# Altium schematic sheet Sensors.A.Data.SchDoc
size A4; SheetNumber: 3; SheetTotal: 4
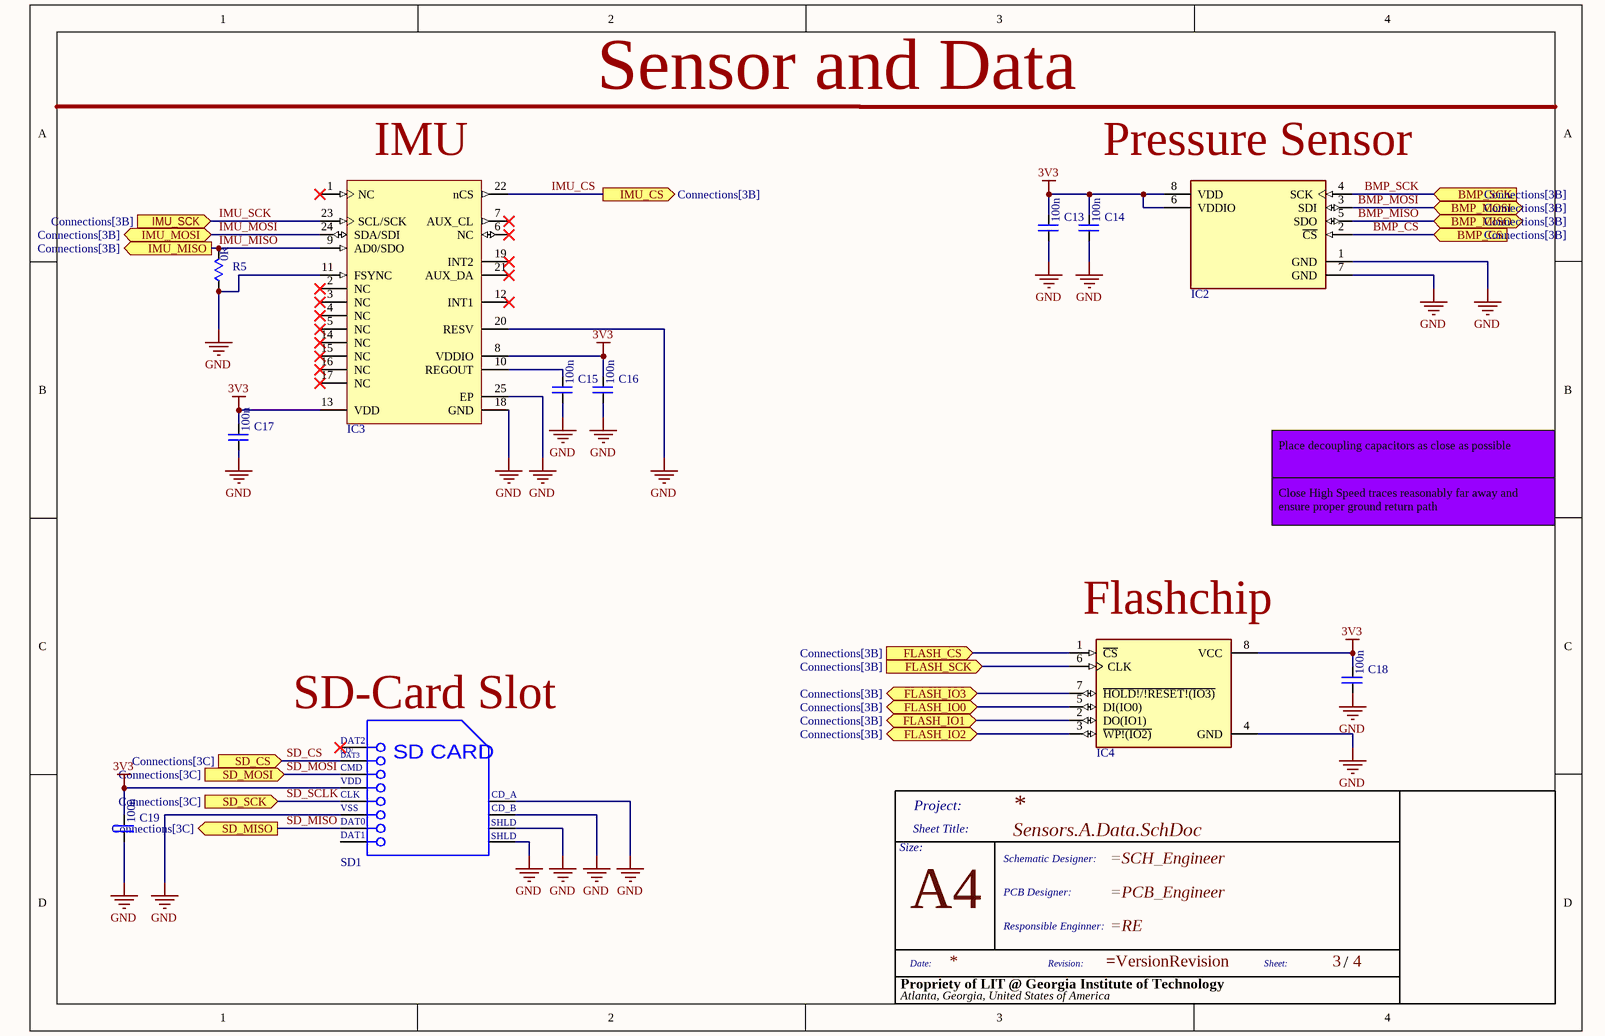
[diagram p0: Sensors.A.Data.SchDoc]

## Parts
*  Size: A4  (hidden comment: TitleBlock)  (graphical)
C13  KGM21NR71E104KT  [CAP-0805]  (value not drawn)
C14  KGM21NR71E104KT  [CAP-0805]  (value not drawn)
C15  KGM21NR71E104KT  [CAP-0805]  (value not drawn)
C16  KGM21NR71E104KT  [CAP-0805]  (value not drawn)
C17  KGM21NR71E104KT  [CAP-0805]  (value not drawn)
C18  KGM21NR71E104KT  [CAP-0805]  (value not drawn)
C19  KGM21NR71E104KT  [CAP-0805]  (value not drawn)
IC2  BME280  [BME280]  (value not drawn)
IC3  ICM-20649  [24-QFN]  (value not drawn)
IC4  W25Q32JVSSIQ  [F-SOIC127P790X216-8N]  (value not drawn)
R5  ERJ-6GEY0R00V  [0805-RES]  (value not drawn)
SD1  1040310811  [MOLX-104031-0811_V]  (value not drawn)

## Ports
BMP_CS (in, see Connections[3B]), BMP_MISO (bidir, see Connections[3B]), BMP_MOSI (bidir, see Connections[3B]), BMP_SCK (in, see Connections[3B]), FLASH_CS (in, see Connections[3B]), FLASH_IO0 (bidir, see Connections[3B]), FLASH_IO1 (bidir, see Connections[3B]), FLASH_IO2 (bidir, see Connections[3B]), FLASH_IO3 (bidir, see Connections[3B]), FLASH_SCK (in, see Connections[3B]), IMU_CS (out, see Connections[3B]), IMU_MISO (out, see Connections[3B]), IMU_MOSI (bidir, see Connections[3B]), IMU_SCK (in, see Connections[3B]), SD_CS (in, see Connections[3C]), SD_MISO (out, see Connections[3C]), SD_MOSI (in, see Connections[3C]), SD_SCK (in, see Connections[3C])

## Nets
3V3: C13.2 C14.2 C16.2 C17.2 C18.2 C19.2 IC2.6(VDDIO) IC2.8(VDD) IC3.8(VDDIO) IC3.13(VDD) IC4.8(VCC) SD1.4(VDD)
GND: C13.1 C14.1 C15.1 C16.1 C17.1 C18.1 C19.1 IC2.1(GND) IC2.7(GND) IC3.11(FSYNC) IC3.18(GND) IC3.20(RESV) IC3.25(EP) IC4.4(GND) R5.1 SD1.6(VSS2) SD1.9(CD_A) SD1.10(CD_B) SD1.11(SHLD1) SD1.12(SHLD2)
BMP_CS: IC2.2(~{CS}) ; port BMP_CS
BMP_MISO: IC2.5(SDO) ; port BMP_MISO
BMP_MOSI: IC2.3(SDI) ; port BMP_MOSI
BMP_SCK: IC2.4(SCK) ; port BMP_SCK
FLASH_CS: IC4.1(~{CS}) ; port FLASH_CS
FLASH_IO0: IC4.5(DI(IO0)) ; port FLASH_IO0
FLASH_IO1: IC4.2(DO(IO1)) ; port FLASH_IO1
FLASH_IO2: IC4.3(~{WP!(IO2)}) ; port FLASH_IO2
FLASH_IO3: IC4.7(~{HOLD!/!RESET!(IO3)}) ; port FLASH_IO3
FLASH_SCK: IC4.6(CLK) ; port FLASH_SCK
IMU_CS: IC3.22(nCS) ; port IMU_CS
IMU_MISO: IC3.9(AD0/SDO) R5.2 ; port IMU_MISO
IMU_MOSI: IC3.24(SDA/SDI) ; port IMU_MOSI
IMU_SCK: IC3.23(SCL/SCK) ; port IMU_SCK
SD_CS: SD1.2(CMD) ; port SD_CS
SD_MISO: SD1.7(DAT0) ; port SD_MISO
SD_MOSI: SD1.3(VSS1) ; port SD_MOSI
SD_SCLK: SD1.5(CLK) ; port SD_SCK
NetC15_2: C15.2 IC3.10(REGOUT)

Not connected (* = marked no-connect by the designer): IC3 1(NC)* 2(NC)* 3(NC)* 4(NC)* 5(NC)* 6(NC)* 7(AUX_CL)* 12(INT1)* 14(NC)* 15(NC)* 16(NC)* 17(NC)* 19(INT2)* 21(AUX_DA)*; SD1 1(CD/DAT3)* 8(DAT1)

## Notes on the sheet
- Sensor and Data
- (near IC3) IMU
- (near IC2) Pressure Sensor
- Close High Speed traces reasonably far away and ensure proper ground return path
- Place decoupling capacitors as close as possible
- (near IC4) Flashchip
- (near SD1) SD-Card Slot
- (in symbol CAP-0805-25V-100n) 100n
- (in symbol microSD-card-connector) DAT2; CD/; DAT3; SD CARD; VSS; SHLD
- (in symbol RES-0805-0R) 0R
- (in symbol TitleBlock) Project:; Sheet Title:; Size:; Schematic Designer:; PCB Designer:; Responsible Enginner:; Date:; Revision:; Sheet:; /; Propriety of LIT @ Georgia Institute of Technology; Atlanta, Georgia, United States of America

## Library data of the parts
* = TitleBlock: Standard Title Block
C13-C19 = CAP-0805-25V-100n: 0.1 µF ±10% 25V Ceramic Capacitor X7R 0805 (2012 Metric)
IC2 = BME280: Pressure Sensor 4.35PSI ~ 15.95PSI (30kPa ~ 110kPa) Absolute 16b 8-SMD
IC3 = IMU-ICM20649-SPI: Accelerometer, Gyroscope, Temperature, 6 Axis Sensor I2C, SPI Output
IC4 = Flashchip-32MBIT-3V3: FLASH - NOR Memory IC 32Mbit SPI - Quad I/O 133 MHz 8-SOIC
R5 = RES-0805-0R: 0 Ohms Jumper Chip Resistor 0805 (2012 Metric) Automotive AEC-Q200 Thick Film
SD1 = microSD-card-connector: 10 (8 + 2) Position Card Connector Secure Digital - microSD™ Surface Mount, Right Angle Gold; Manufacturer: Molex; Parameter 2: 1040310811